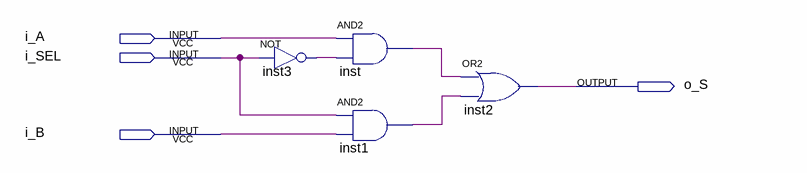
[diagram p0: schematic sheet]
// Quartus schematic mux21_1b.bdf as structural Verilog: 4 symbols, 4 pins
module mux21_1b (
  input  i_A,
  input  i_SEL,
  input  i_B,
  output o_S
);

  wire inst1_out, inst3_out, inst_out;

  not inst3 (inst3_out, i_SEL);
  and inst (inst_out, i_A, inst3_out);
  and inst1 (inst1_out, i_SEL, i_B);
  or inst2 (o_S, inst_out, inst1_out);
endmodule
